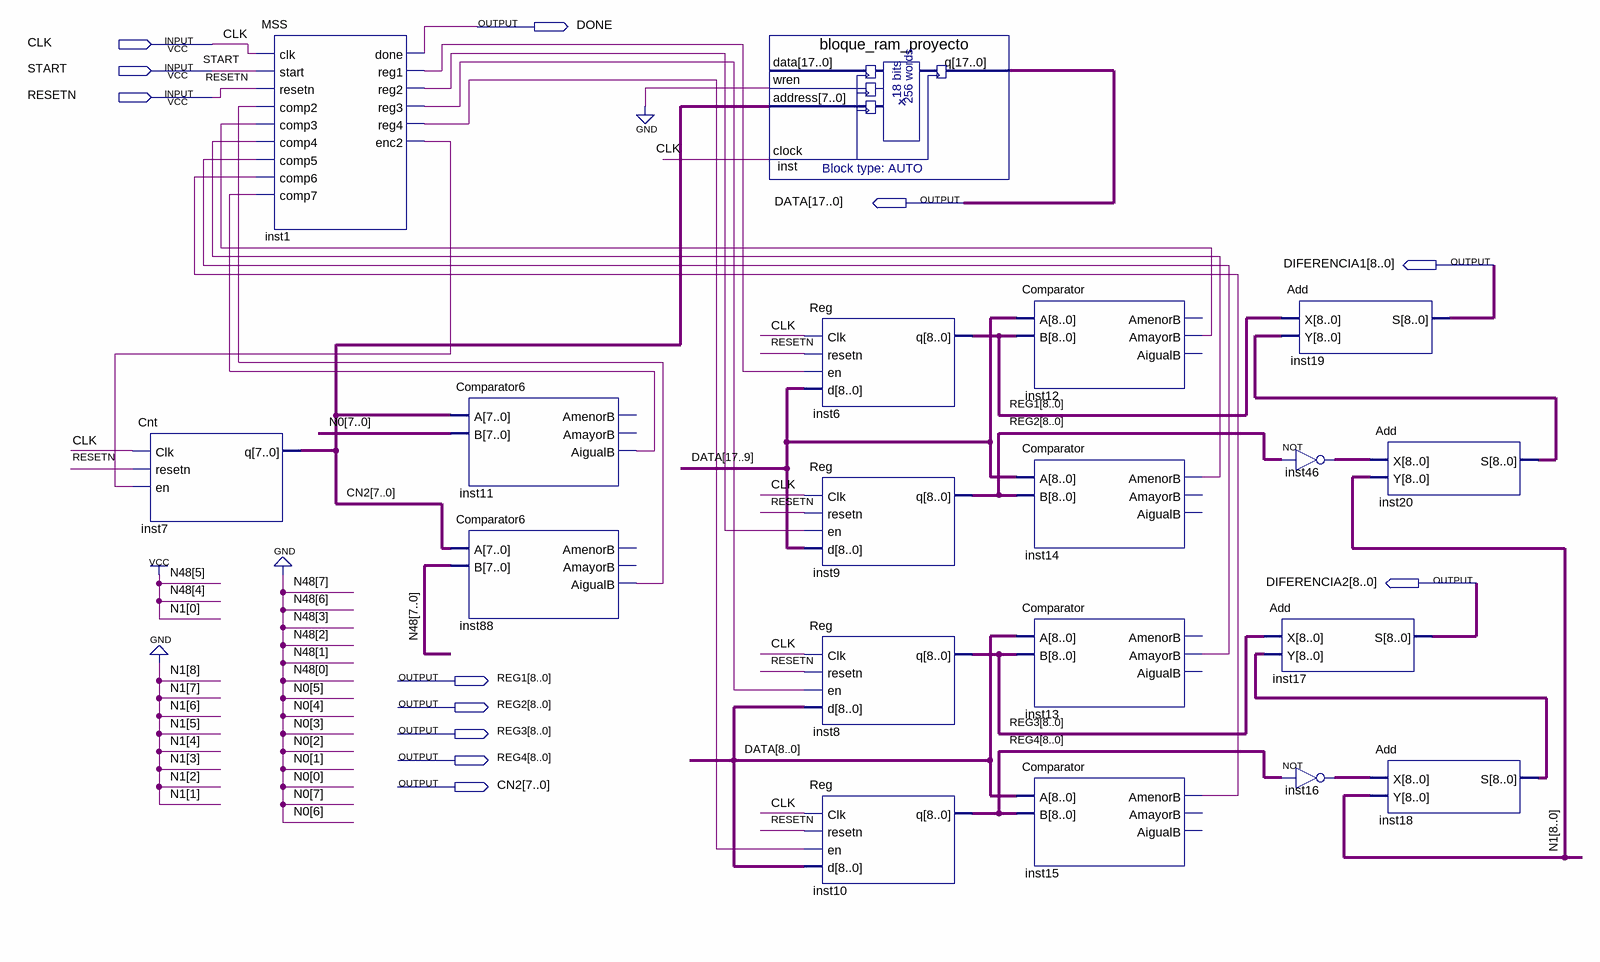
[diagram p0: schematic sheet]
// Quartus schematic Diagrama.bdf as structural Verilog: 19 symbols, 12 pins
module Diagrama (
  input  CLK,
  input  START,
  input  RESETN,
  output DONE,
  output [17:0] DATA,
  output [8:0] DIFERENCIA1,
  output [8:0] DIFERENCIA2,
  output [8:0] REG1,
  output [8:0] REG2,
  output [8:0] REG3,
  output [8:0] REG4,
  output [7:0] CN2
);

  wire inst1_enc2, inst1_reg1, inst1_reg2, inst1_reg3, inst1_reg4, inst11_aigualb, inst12_amayorb,
       inst13_amayorb, inst14_amenorb, inst15_amenorb, inst88_aigualb;
  wire [8:0] inst16_out, inst18_s, inst20_s, inst46_out;

  Cnt inst7 (.Clk(CLK), .resetn(RESETN), .en(inst1_enc2), .q(CN2));
  MSS inst1 (
    .clk(CLK), .start(START), .resetn(RESETN), .comp2(inst88_aigualb), .comp3(inst12_amayorb),
    .comp4(inst14_amenorb), .comp5(inst13_amayorb), .comp6(inst15_amenorb), .comp7(inst11_aigualb),
    .done(DONE), .reg1(inst1_reg1), .reg2(inst1_reg2), .reg3(inst1_reg3), .reg4(inst1_reg4), .enc2(inst1_enc2));
  Comparator6 inst11 (.A(CN2), .B({8{1'b0}}), .AigualB(inst11_aigualb));  // open: AmenorB, AmayorB
  Comparator6 inst88 (.A(CN2), .B(8'b00110000), .AigualB(inst88_aigualb));  // open: AmenorB, AmayorB
  bloque_ram_proyecto inst (.wren(1'b0), .address(CN2), .clock(CLK), .q(DATA));  // open: data
  Reg inst6 (.Clk(CLK), .resetn(RESETN), .en(inst1_reg1), .d(DATA[17:9]), .q(REG1));
  Reg inst9 (.Clk(CLK), .resetn(RESETN), .en(inst1_reg2), .d(DATA[17:9]), .q(REG2));
  Reg inst8 (.Clk(CLK), .resetn(RESETN), .en(inst1_reg3), .d(DATA[8:0]), .q(REG3));
  Reg inst10 (.Clk(CLK), .resetn(RESETN), .en(inst1_reg4), .d(DATA[8:0]), .q(REG4));
  Comparator inst12 (.A(DATA[17:9]), .B(REG1), .AmayorB(inst12_amayorb));  // open: AmenorB, AigualB
  Comparator inst14 (.A(DATA[17:9]), .B(REG2), .AmenorB(inst14_amenorb));  // open: AmayorB, AigualB
  Comparator inst13 (.A(DATA[8:0]), .B(REG3), .AmayorB(inst13_amayorb));  // open: AmenorB, AigualB
  Comparator inst15 (.A(DATA[8:0]), .B(REG4), .AmenorB(inst15_amenorb));  // open: AmayorB, AigualB
  Add inst19 (.X(REG1), .Y(inst20_s), .S(DIFERENCIA1));
  assign inst46_out = ~REG2;  // NOT inst46, 9 bits wide
  Add inst17 (.X(REG3), .Y(inst18_s), .S(DIFERENCIA2));
  assign inst16_out = ~REG4;  // NOT inst16, 9 bits wide
  Add inst20 (.X(inst46_out), .Y(9'b000000001), .S(inst20_s));
  Add inst18 (.X(inst16_out), .Y(9'b000000001), .S(inst18_s));
endmodule
